# EAGLE schematic SENSOR 8 signal (EAGLE 5.06)
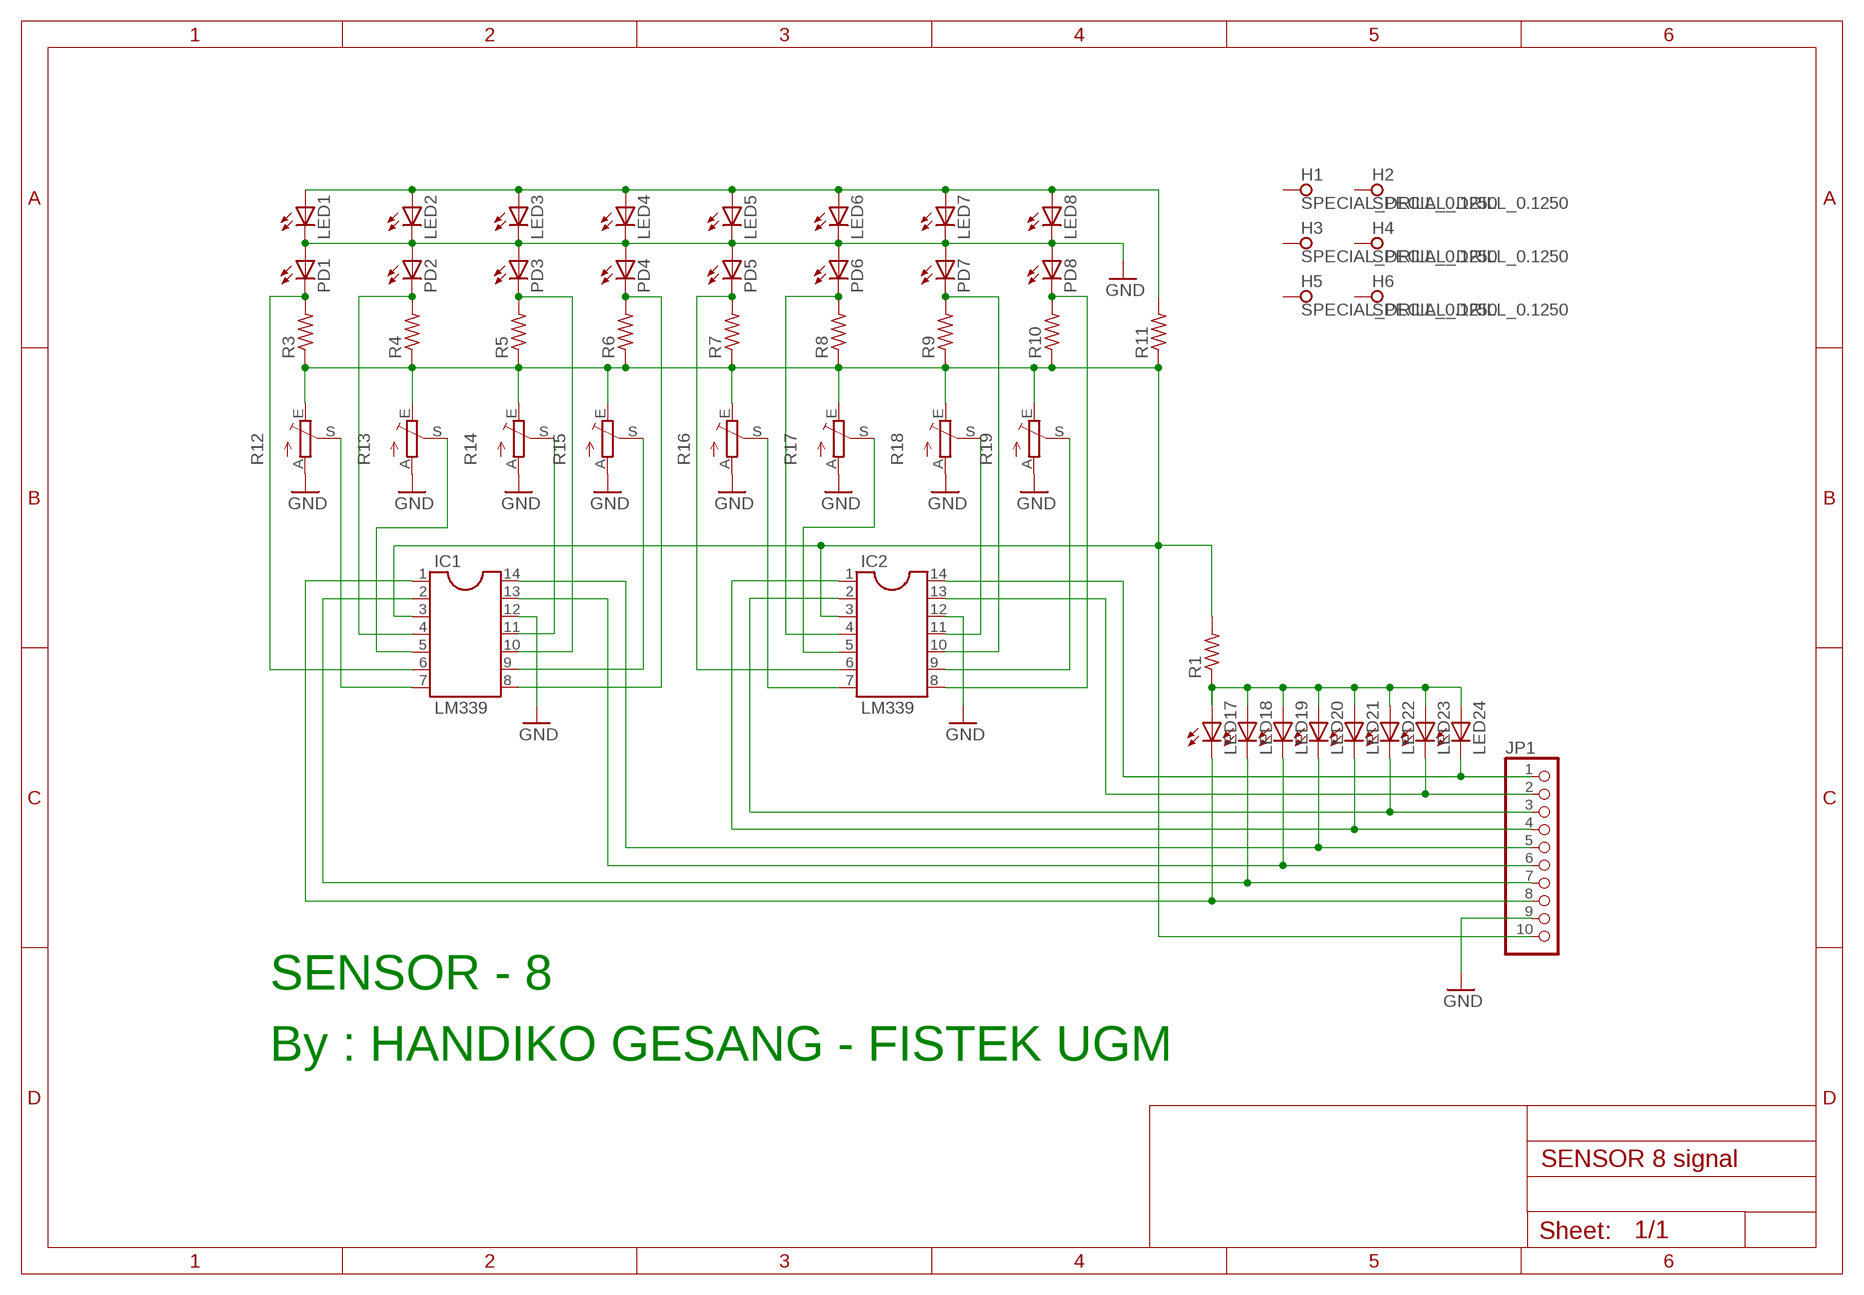
[diagram p0: schematic, sheet 1]

## Parts
H1  SPECIAL_DRILL_0.1250  [PAD_0.1250]
H2  SPECIAL_DRILL_0.1250  [PAD_0.1250]
H3  SPECIAL_DRILL_0.1250  [PAD_0.1250]
H4  SPECIAL_DRILL_0.1250  [PAD_0.1250]
H5  SPECIAL_DRILL_0.1250  [PAD_0.1250]
H6  SPECIAL_DRILL_0.1250  [PAD_0.1250]
IC1  LM339  DIL14  [DIL14]
IC2  LM339  DIL14  [DIL14]
JP1  PINHD-1X10  [1X10]
LED1  LED5MM  [LED5MM]
LED2  LED5MM  [LED5MM]
LED3  LED5MM  [LED5MM]
LED4  LED5MM  [LED5MM]
LED5  LED5MM  [LED5MM]
LED6  LED5MM  [LED5MM]
LED7  LED5MM  [LED5MM]
LED8  LED5MM  [LED5MM]
LED17  LED5MM  [LED5MM]
LED18  LED5MM  [LED5MM]
LED19  LED5MM  [LED5MM]
LED20  LED5MM  [LED5MM]
LED21  LED5MM  [LED5MM]
LED22  LED5MM  [LED5MM]
LED23  LED5MM  [LED5MM]
LED24  LED5MM  [LED5MM]
PD1  LED5MM  [LED5MM]
PD2  LED5MM  [LED5MM]
PD3  LED5MM  [LED5MM]
PD4  LED5MM  [LED5MM]
PD5  LED5MM  [LED5MM]
PD6  LED5MM  [LED5MM]
PD7  LED5MM  [LED5MM]
PD8  LED5MM  [LED5MM]
R1  R-US_0309/10  [0309/10]
R3  R-US_0309/10  [0309/10]
R4  R-US_0309/10  [0309/10]
R5  R-US_0309/10  [0309/10]
R6  R-US_0309/10  [0309/10]
R7  R-US_0309/10  [0309/10]
R8  R-US_0309/10  [0309/10]
R9  R-US_0309/10  [0309/10]
R10  R-US_0309/10  [0309/10]
R11  R-US_0309/10  [0309/10]
R12  TRIM_EU-LI10  [LI10]
R13  TRIM_EU-LI10  [LI10]
R14  TRIM_EU-LI10  [LI10]
R15  TRIM_EU-LI10  [LI10]
R16  TRIM_EU-LI10  [LI10]
R17  TRIM_EU-LI10  [LI10]
R18  TRIM_EU-LI10  [LI10]
R19  TRIM_EU-LI10  [LI10]

## Nets
GND: IC1.12 IC2.12 JP1.9 LED1.K(C) LED2.K(C) LED3.K(C) LED4.K(C) LED5.K(C) LED6.K(C) LED7.K(C) LED8.K(C) PD1.A PD2.A PD3.A PD4.A PD5.A PD6.A PD7.A PD8.A R12.A R13.A R14.A R15.A R16.A R17.A R18.A R19.A
N$2: LED17.A LED18.A LED19.A LED20.A LED21.A LED22.A LED23.A LED24.A R1.1
N$9: IC1.6 PD1.K(C) R3.2
N$10: IC1.4 PD2.K(C) R4.2
N$11: IC1.10 PD3.K(C) R5.2
N$12: IC1.8 PD4.K(C) R6.2
N$13: IC2.6 PD5.K(C) R7.2
N$14: IC2.4 PD6.K(C) R8.2
N$15: IC2.10 PD7.K(C) R9.2
N$16: IC2.8 PD8.K(C) R10.2
N$18: IC1.3 IC2.3 JP1.10 R1.2 R3.1 R4.1 R5.1 R6.1 R7.1 R8.1 R9.1 R10.1 R11.1 R12.E R13.E R14.E R15.E R16.E R17.E R18.E R19.E
N$19: LED1.A LED2.A LED3.A LED4.A LED5.A LED6.A LED7.A LED8.A R11.2
N$20: IC1.7 R12.S
N$21: IC1.5 R13.S
N$22: IC1.11 R14.S
N$23: IC1.9 R15.S
N$24: IC2.7 R16.S
N$25: IC2.5 R17.S
N$26: IC2.11 R18.S
N$27: IC2.9 R19.S
N$28: IC2.14 JP1.1 LED24.K(C)
N$29: IC2.13 JP1.2 LED23.K(C)
N$30: IC2.2 JP1.3 LED22.K(C)
N$31: IC2.1 JP1.4 LED21.K(C)
N$32: IC1.14 JP1.5 LED20.K(C)
N$33: IC1.13 JP1.6 LED19.K(C)
N$34: IC1.2 JP1.7 LED18.K(C)
N$35: IC1.1 JP1.8 LED17.K(C)
Unconnected: H1.1 H2.1 H3.1 H4.1 H5.1 H6.1

## Notes on the sheet
- SENSOR - 8
- By : HANDIKO GESANG - FISTEK UGM

## Library data of the parts
H1-H6 = special-drill:SPECIAL_DRILL_: Special drills
IC1 IC2 = ic-package:DIL14: Dual In Line / Socket
JP1 = pinhead:PINHD-1X10: PIN HEADER
LED1-LED8 LED17-LED24 PD1-PD8 = led:LED: LED OSRAM: - CHIPLED LG R971, LG N971, LY N971, LG Q971, LY Q971, LO R971, LY R971 LH N974, LH R974 LS Q976, LO Q976, LY Q976 LO Q996 - Hyper CHIPLED LW Q18S LB Q993, LB Q99A, LB R99A - SideLED LS A670, LO A670, LY A670, LG A670, LP A670 LB A673, LV A673, LT A673, LW A673 LH A674 LY A675 LS A676, LA A676, LO A676, LY A676, LW A676 LS A679, LY A679, LG A679 - Hyper Micro SIDELED® LS Y876, LA Y876, LO Y876, LY Y876 LT Y87S - SmartLED LW L88C, LW L88S LB L89C, LB L89S, LG L890 LS L89K, LO L89K, LY L89K LS L896, LA L896, LO L896, LY L896 - TOPLED LS T670, LO T670, LY T670, LG T670, LP T670 LSG T670, LSP T670, LSY T670, LOP T670, LYG T670 LG T671, LOG T671, LSG T671 LB T673, LV T673, LT T673, LW T673 LH T674 LS T676, LA T676, LO T676, LY T676, LB T676, LH T676, LSB T676, LW T676 LB T67C, LV T67C, LT T67C, LS T67K, LO T67K, LY T67K, LW E67C LS E67B, LA E67B, LO E67B, LY E67B, LB E67C, LV E67C, LT E67C LW T67C LS T679, LY T679, LG T679 LS T770, LO T770, LY T770, LG T770, LP T770 LB T773, LV T773, LT T773, LW T773 LH T774 LS E675, LA E675, LY E675, LS T675 LS T776, LA T776, LO T776, LY T776, LB T776 LHGB T686 LT T68C, LB T68C - Hyper Mini TOPLED® LB M676 - Mini TOPLED Santana® LG M470 LS M47K, LO M47K, LY M47K Source: http://www.osram.convergy.de LUXEON: - LUMILED® LXK2-PW12-R00, LXK2-PW12-S00, LXK2-PW14-U00, LXK2-PW14-V00 LXK2-PM12-R00, LXK2-PM12-S00, LXK2-PM14-U00 LXK2-PE12-Q00, LXK2-PE12-R00, LXK2-PE12-S00, LXK2-PE14-T00, LXK2-PE14-U00 LXK2-PB12-K00, LXK2-PB12-L00, LXK2-PB12-M00, LXK2-PB14-N00, LXK2-PB14-P00, LXK2-PB14-Q00 LXK2-PR12-L00, LXK2-PR12-M00, LXK2-PR14-Q00, LXK2-PR14-R00 LXK2-PD12-Q00, LXK2-PD12-R00, LXK2-PD12-S00 LXK2-PH12-R00, LXK2-PH12-S00 LXK2-PL12-P00, LXK2-PL12-Q00, LXK2-PL12-R00 Source: www.luxeon.com KINGBRIGHT: KA-3528ASYC Source: www.kingbright.com
R1 R3-R11 = resistor:R-US_: RESISTOR, American symbol
R12-R19 = pot:TRIM_EU-: POTENTIOMETER